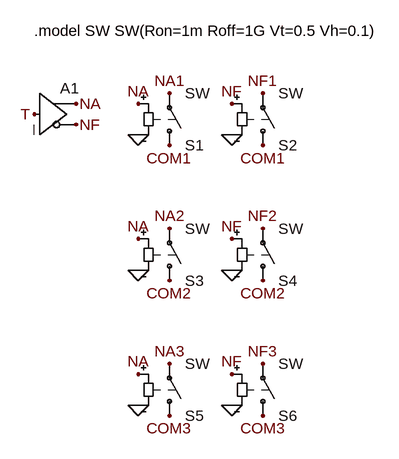
[diagram p0: schematic 3PDTg.asc]
3PDTg.asc, the LTspice schematic file:
Version 4
SHEET 1 880 680
FLAG -272 80 NA
FLAG -272 112 NF
FLAG -176 80 NA
FLAG -32 80 NF
FLAG -32 128 0
FLAG -176 128 0
FLAG -336 96 T
FLAG -128 144 COM1
FLAG 16 144 COM1
FLAG -128 64 NA1
FLAG 16 64 NF1
FLAG -176 288 NA
FLAG -32 288 NF
FLAG -32 336 0
FLAG -176 336 0
FLAG -128 352 COM2
FLAG 16 352 COM2
FLAG -128 272 NA2
FLAG 16 272 NF2
FLAG -176 496 NA
FLAG -32 496 NF
FLAG -32 544 0
FLAG -176 544 0
FLAG -128 560 COM3
FLAG 16 560 COM3
FLAG -128 480 NA3
FLAG 16 480 NF3
SYMBOL sw -128 160 M180
SYMATTR InstName S1
SYMBOL Digital\\buf -336 32 R0
SYMATTR InstName A1
SYMBOL sw 16 160 M180
SYMATTR InstName S2
SYMBOL sw -128 368 M180
SYMATTR InstName S3
SYMBOL sw 16 368 M180
SYMATTR InstName S4
SYMBOL sw -128 576 M180
SYMATTR InstName S5
SYMBOL sw 16 576 M180
SYMATTR InstName S6
TEXT -336 -32 Left 2 !.model SW SW(Ron=1m Roff=1G Vt=0.5 Vh=0.1)

The netlist it stands for:
* 3PDTg.asc
S1 COM1 NA1 NA 0 SW
A1 T 0 0 0 0 NF NA 0 BUF
S2 COM1 NF1 NF 0 SW
S3 COM2 NA2 NA 0 SW
S4 COM2 NF2 NF 0 SW
S5 COM3 NA3 NA 0 SW
S6 COM3 NF3 NF 0 SW
.model SW SW(Ron=1m Roff=1G Vt=0.5 Vh=0.1)
.backanno
.end